# EAGLE design ESP32-12S (EAGLE 9.7.0)
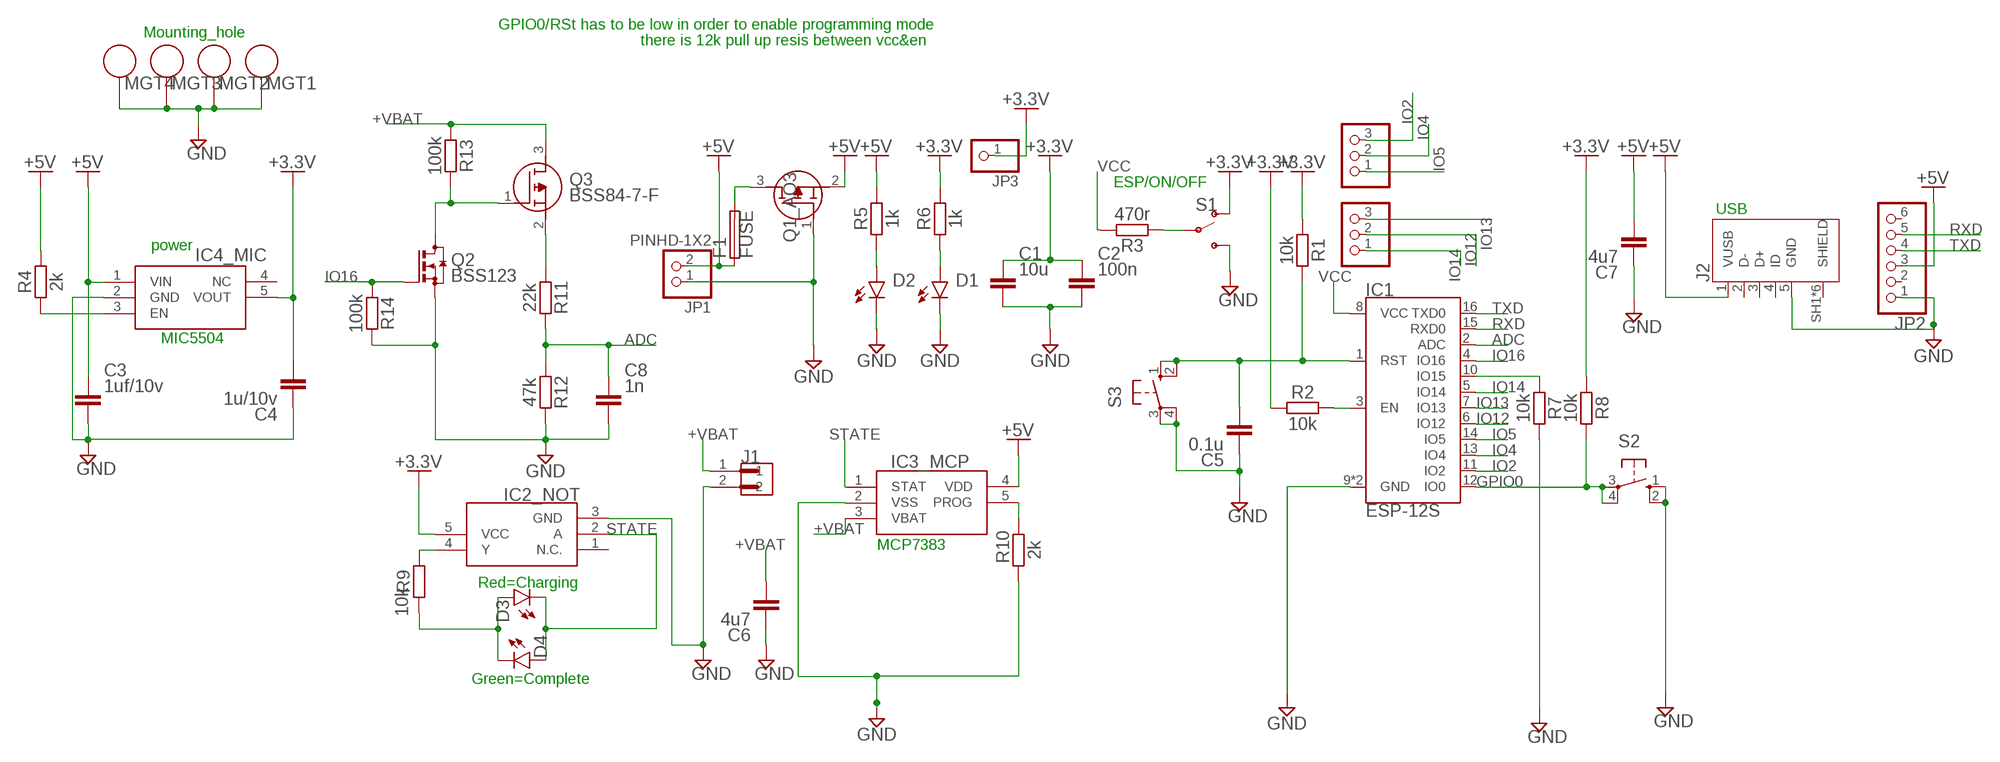
[diagram p0: schematic, sheet 1]

## Parts
C1  10u  C_CHIP-0603(1608-METRIC)  [CAPC1608X85]
C2  100n  C_CHIP-0603(1608-METRIC)  [CAPC1608X85]
C3  1uf/10v  C_CHIP-0805(2012-METRIC)  [CAPC2012X110]
C4  1u/10v  C_CHIP-0805(2012-METRIC)  [CAPC2012X110]
C5  0.1u  C_CHIP-0603(1608-METRIC)  [CAPC1608X85]
C6  4u7  C_CHIP-0603(1608-METRIC)  [CAPC1608X85]
C7  4u7  C_CHIP-0603(1608-METRIC)  [CAPC1608X85]
C8  1n  C_CHIP-0603(1608-METRIC)  [CAPC1608X85]
D1  CHIP-ROUND-R_0805  [LEDC2012X105N_RND-R]
D2  CHIP-ROUND-R_0805  [LEDC2012X105N_RND-R]
D3  CHIP-ROUND-R_0805  [LEDC2012X105N_RND-R]
D4  CHIP-ROUND-R_0805  [LEDC2012X105N_RND-R]
F1  FUSE  FUSE_CHIP-0603(1608-METRIC)  [FUSC1608X60N]
IC1  ESP-12S  [ESP-12S]
IC2_NOT  74HC1G04GW,125  [SOT65P212X110-5N]
IC3_MCP  MCP73831T-2ATI_OT  [SOT95P270X145-5N]
IC4_MIC  MIC5504-3.3YM5-TR  [SOT95P280X145-5N]
J1  S2B-XH-A(LF)(SN)  [JST_S2B-XH-A(LF)(SN)]
J2  10118192-0001LF  [AMPHENOL_10118192-0001LF]
JP1  PINHD-1X2  [1X02]
JP2  PINHD-1X6  [1X06]
JP3  PINHD-1X1  [1X01]
JP4  PINHD-1X3  [1X03]
JP5  PINHD-1X3  [1X03]
MGT1  BEAGLEBONEBLACK_MOUNTING_HOLE  [BEAGLEBONEBLACK_MOUNTING_HOLE]
MGT2  BEAGLEBONEBLACK_MOUNTING_HOLE  [BEAGLEBONEBLACK_MOUNTING_HOLE]
MGT3  BEAGLEBONEBLACK_MOUNTING_HOLE  [BEAGLEBONEBLACK_MOUNTING_HOLE]
MGT4  BEAGLEBONEBLACK_MOUNTING_HOLE  [BEAGLEBONEBLACK_MOUNTING_HOLE]
Q1_AO3  AO3401A  [SOT95P280X125-3N]
Q2  BSS123  [SOT23]
Q3  BSS84-7-F  [SOT96P240X110-3N]
R1  10k  R_CHIP-0603(1608-METRIC)  [RESC1608X60]
R2  10k  R_CHIP-0603(1608-METRIC)  [RESC1608X60]
R3  470r  R_CHIP-0603(1608-METRIC)  [RESC1608X60]
R4  2k  R_CHIP-0603(1608-METRIC)  [RESC1608X60]
R5  1k  R_CHIP-0603(1608-METRIC)  [RESC1608X60]
R6  1k  R_CHIP-0603(1608-METRIC)  [RESC1608X60]
R7  10k  R_CHIP-0603(1608-METRIC)  [RESC1608X60]
R8  10k  R_CHIP-0603(1608-METRIC)  [RESC1608X60]
R9  10k  R_CHIP-0603(1608-METRIC)  [RESC1608X60]
R10  2k  R_CHIP-0603(1608-METRIC)  [RESC1608X60]
R11  22k  R_CHIP-1206(3216-METRIC)  [RESC3216X70]
R12  47k  R_CHIP-1206(3216-METRIC)  [RESC3216X70]
R13  100k  R_CHIP-1206(3216-METRIC)  [RESC3216X70]
R14  100k  R_CHIP-1206(3216-METRIC)  [RESC3216X70]
S1  SWITCH-SPDT-SMD-RIGHT-ANGLE  [SWITCH_SPST_SMD_A]
S2  10-XX  [B3F-10XX]
S3  10-XX  [B3F-10XX]

## Nets
+3.3V: C1.1 C2.1 C4.2 IC2_NOT.5(VCC) IC4_MIC.5(VOUT) JP3.1 R1.1 R2.1 R6.2 R8.1 S1.1(O)
+5V: C3.1 C7.2 F1.1 IC3_MCP.4(VDD) IC4_MIC.1(VIN) J2.1(VUSB) JP1.2 JP2.3 Q1_AO3.2(S) R4.2 R5.2
+VBAT: C6.2 IC3_MCP.3(VBAT) J1.1 Q3.3(D) R13.1
ADC: C8.1 IC1.2(ADC) R11.2 R12.1
GND: C1.2 C2.2 C3.2 C4.1 C5.1 C6.1 C7.1 C8.2 D1.C D2.C IC1.9(GND) IC1.P$1(GND) IC2_NOT.3(GND) IC3_MCP.2(VSS) IC4_MIC.2(GND) J1.2 J2.5(GND) JP1.1 JP2.1 MGT1.P$1 MGT2.P$1 MGT3.P$1 MGT4.P$1 Q1_AO3.1(G) Q2.2(S) R7.2 R10.1 R12.2 R14.2 S1.3(S) S2.1(S) S2.2(S1) S3.3(P) S3.4(P1)
GPIO0: IC1.12(IO0) R8.2 S2.3(P) S2.4(P1)
IO2: IC1.11(IO2) JP4.3
IO4: IC1.13(IO4) JP4.2
IO5: IC1.14(IO5) JP4.1
IO12: IC1.6(IO12) JP5.2
IO13: IC1.7(IO13) JP5.3
IO14: IC1.5(IO14) JP5.1
IO16: IC1.4(IO16) Q2.1(G) R14.1
N$2: IC1.3(EN) R2.2
N$3: IC4_MIC.3(EN) R4.1
N$4: D1.A R6.1
N$5: D2.A R5.1
N$7: IC1.10(IO15) R7.1
N$9: F1.2 Q1_AO3.3(D)
N$10: IC3_MCP.5(PROG) R10.2
N$11: R3.1 S1.2(P)
N$12: Q3.2(S) R11.1
N$13: IC2_NOT.4(Y) R9.2
N$14: D3.A D4.C R9.1
N$15: Q2.3(D) Q3.1(G) R13.2
RST: C5.2 IC1.1(RST) R1.2 S3.1(S) S3.2(S1)
RXD: IC1.15(RXD0) JP2.5
STATE: D3.C D4.A IC2_NOT.2(A) IC3_MCP.1(STAT)
TXD: IC1.16(TXD0) JP2.4
VCC: IC1.8(VCC) R3.2
Unconnected: IC2_NOT.1(N.C.) IC4_MIC.4(NC) J2.2(D-) J2.3(D+) J2.4(ID) J2.SH1(SHIELD) J2.SH2(SHIELD) J2.SH3(SHIELD) J2.SH4(SHIELD) J2.SH5(SHIELD) J2.SH6(SHIELD) JP2.2 JP2.6

## Notes on the sheet
- GPIO0/RSt has to be low in order to enable programming mode
- Mounting_hole
- there is 12k pull up resis between vcc&en
- ESP/ON/OFF
- USB
- power
- MIC5504
- MCP7383
- Red=Charging
- Green=Complete

## Library data of the parts
C1-C8 = Capacitor:C: Capacitor - Generic; CATEGORY: Capacitor
D1-D4 = LED:CHIP-ROUND-R: LED - Generic; CATEGORY: LED; COLOR: RED; DESCRIPTION: CHIP LED ROUND; SUB-CATEGORY: CHIP; TYPE: ROUND_TOP
F1 = Circuit-Protection:FUSE: Fuse - Generic; CATEGORY: Circuit-Protection; SUB-CATEGORY: Fuse
IC1 = ESP-12SSS:ESP-12S: AI-Thinker ESP-12S ESP-12S WiFi module is developed by AI-Thinker Co.,Ltd, core processor ESP8266 in smaller sizes of the module encapsulates Tensilica L106 integrates industry-leading ultra low power 32-bit MCU micro, with the 16-bit short mode, clock speed support 80 MHz, 160 MHz, supports the RTOS, integrated Wi-Fi MAC/BB/RF/PA/LNA, on-board antennas.; PROD_ID: IC-14115
IC2_NOT = NOT_74HC1G04GW_125:74HC1G04GW,125: Nexperia 74HC1G04GW,125 CMOS Inverter, 2 6 V, 5-Pin TSSOP Source: Datasheet <https://assets.nexperia.com/documents/data-sheet/74HC_HCT1G04.pdf>; ARROW_PART_NUMBER: 74HC1G04GW,125; ARROW_PRICE-STOCK: https://www.arrow.com/en/products/74hc1g04gw125/nexperia; DESCRIPTION: Nexperia 74HC1G04GW,125 CMOS Inverter, 2 6 V, 5-Pin TSSOP; HEIGHT: 1.1mm; MANUFACTURER_NAME: Nexperia; MANUFACTURER_PART_NUMBER: 74HC1G04GW,125; MOUSER_PART_NUMBER: 771-74HC1G04GW-G; MOUSER_PRICE-STOCK: https://www.mouser.co.uk/ProductDetail/Nexperia/74HC1G04GW125?qs=P62ublwmbi%2FJWY9CPTNoyA%3D%3D
IC3_MCP = MCP73831T-2ATI_OT:MCP73831T-2ATI_OT: Microchip MCP73831T-2ATI/OT, Battery Charge Controller Lithium-Ion/Polymer, 500mA, 5-pin SOT-23 Source: Datasheet <http://docs-emea.rs-online.com/webdocs/1381/0900766b81381747.pdf>; ARROW_PART_NUMBER: MCP73831T-2ATI/OT; ARROW_PRICE-STOCK: https://www.arrow.com/en/products/mcp73831t-2atiot/microchip-technology; DESCRIPTION: Microchip MCP73831T-2ATI/OT, Battery Charge Controller Lithium-Ion/Polymer, 500mA, 5-pin SOT-23; HEIGHT: 1.45mm; MANUFACTURER_NAME: Microchip; MANUFACTURER_PART_NUMBER: MCP73831T-2ATI/OT; MOUSER_PART_NUMBER: 579-MCP73831T-2ATIOT; MOUSER_PRICE-STOCK: https://www.mouser.co.uk/ProductDetail/Microchip-Technology/MCP73831T-2ATI-OT?qs=yUQqVecv4qsZbioEUu%252B83g%3D%3D
IC4_MIC = MIC5504-3.3YM5-TR:MIC5504-3.3YM5-TR: MICROCHIP - MIC5504-3.3YM5-TR - LDO VOLT REG, 0.3A, 3.3V, SOT-23-5 Source: Datasheet <https://componentsearchengine.com/Datasheets/2/MIC5504-3.3YM5-TR.pdf>; ARROW_PART_NUMBER: MIC5504-3.3YM5-TR; ARROW_PRICE-STOCK: https://www.arrow.com/en/products/mic5504-3.3ym5-tr/microchip-technology; DESCRIPTION: MICROCHIP - MIC5504-3.3YM5-TR - LDO VOLT REG, 0.3A, 3.3V, SOT-23-5; HEIGHT: 1.45mm; MANUFACTURER_NAME: Microchip; MANUFACTURER_PART_NUMBER: MIC5504-3.3YM5-TR; MOUSER_PART_NUMBER: 998-MIC5504-3.3YM5TR; MOUSER_PRICE-STOCK: https://www.mouser.co.uk/ProductDetail/Microchip-Technology-Micrel/MIC5504-33YM5-TR/?qs=U6T8BxXiZAUmVQ5Zs217qQ%3D%3D
J1 = S2B-XH-A_LF__SN_(2.54mm):S2B-XH-A(LF)(SN): XH Series 2.5mm 2 Position Through Hole Shrouded Header Connector; MANUFACTURER: JST
J2 = USB-micro:10118192-0001LF: Single Port 5 Contact Horizontal Right Angle Shielded Micro B USB 2.0 Connector; MANUFACTURER: Amphenol; PARTREV: B; STANDARD: Manufacturer Recommendation
JP1 = Connector:PINHD-1X2: PIN HEADER; CATEGORY: CONNECTOR; SUB-CATEGORY: PIN-HEADER
JP2 = Connector:PINHD-1X6: PIN HEADER; CATEGORY: CONNECTOR; SUB-CATEGORY: PIN-HEADER
JP3 = Connector:PINHD-1X1: PIN HEADER; CATEGORY: CONNECTOR; SUB-CATEGORY: PIN-HEADER
JP4 JP5 = Connector:PINHD-1X3: PIN HEADER; CATEGORY: CONNECTOR; SUB-CATEGORY: PIN-HEADER
MGT1-MGT4 = BeagleBone_Black_Wireless:BEAGLEBONEBLACK_MOUNTING_HOLE: Chassis Mounting Hole w/GND connection ability
Q1_AO3 = AO3401A:AO3401A: 30V P-Channel MOSFET Source: Datasheet <http://www.aosmd.com/pdfs/datasheet/AO3401A.pdf>; ARROW_PART_NUMBER: AO3401A; ARROW_PRICE-STOCK: https://www.arrow.com/en/products/ao3401a/alpha-and-omega-semiconductor; DESCRIPTION: 30V P-Channel MOSFET; HEIGHT: 1.25mm; MANUFACTURER_NAME: Alpha & Omega Semiconductors; MANUFACTURER_PART_NUMBER: AO3401A
Q2 = BSS123:BSS123: N-CHANNEL MOS FET
Q3 = BSS84-7-F:BSS84-7-F: MOSFET P-Channel 50V 0.13A SOT23 Diodes Inc BSS84-7-F P-channel MOSFET Transistor, 0.13 A, -50 V, 3-Pin SOT-23 Source: Datasheet <https://www.diodes.com/assets/Datasheets/ds30149.pdf>; ARROW_PART_NUMBER: BSS84-7-F; ARROW_PRICE-STOCK: https://www.arrow.com/en/products/bss84-7-f/diodes-incorporated; DESCRIPTION: MOSFET P-Channel 50V 0.13A SOT23 Diodes Inc BSS84-7-F P-channel MOSFET Transistor, 0.13 A, -50 V, 3-Pin SOT-23; HEIGHT: 1.1mm; MANUFACTURER_NAME: Diodes Inc.; MANUFACTURER_PART_NUMBER: BSS84-7-F; MOUSER_PART_NUMBER: 621-BSS84-F; MOUSER_PRICE-STOCK: https://www.mouser.co.uk/ProductDetail/Diodes-Incorporated/BSS84-7-F?qs=7h%252BLin1yaw0vxJLRgtEgKA%3D%3D
R1-R14 = Resistor:R: Resistor Fixed - Generic; CATEGORY: Resistor; SUB-CATEGORY: Fixed
S1 = One_Dimensional_Pong:SWITCH-SPDT: Single Pole, Double Throw (SPDT) Switch Single-pole, double-throw (SPDT) switch. Variant Overview SMD-AYZ0202 Surface Mount DPDT Switch <https://www.sparkfun.com/products/597> (COM-00597) Used on e.g. LilyPad Arduino USB - ATmega32U4 Board <https://www.sparkfun.com/products/12049> PTH-11.6X4.0MM SPDT Mini Power Switch <https://www.sparkfun.com/products/102> (COM-00102) Used on e.g. SparkFun Simon Says - Through-Hole Soldering Kit <https://www.sparkfun.com/products/10547> (KIT-10547) PTH-11.6X4.0MM-KIT KIT version of SPDT Mini Power Switch - Simplifies soldering by removing tStop of switch pins - only one side can be soldered. PTH-11.6X4.0MM-LOCK LOCK version of SPDT Mini Power Switch - Offset pins hold switch in place for easier soldering. SMD-RIGHT-ANGLE Surface Mount Right Angle Switch <https://www.sparkfun.com/products/10860> (COM-10860) Used on e.g. SparkFun ESP8266 Thing <https://www.sparkfun.com/products/13231>; PROD_ID: SWCH-10651; SF_ID: COM-00597; SF_SKU: COM-10860
S2 S3 = DC_LOAD_AU:10-XX: OMRON SWITCH; MPN: B3F-1000; OC_FARNELL: 176432; OC_NEWARK: 36M3542

## Board
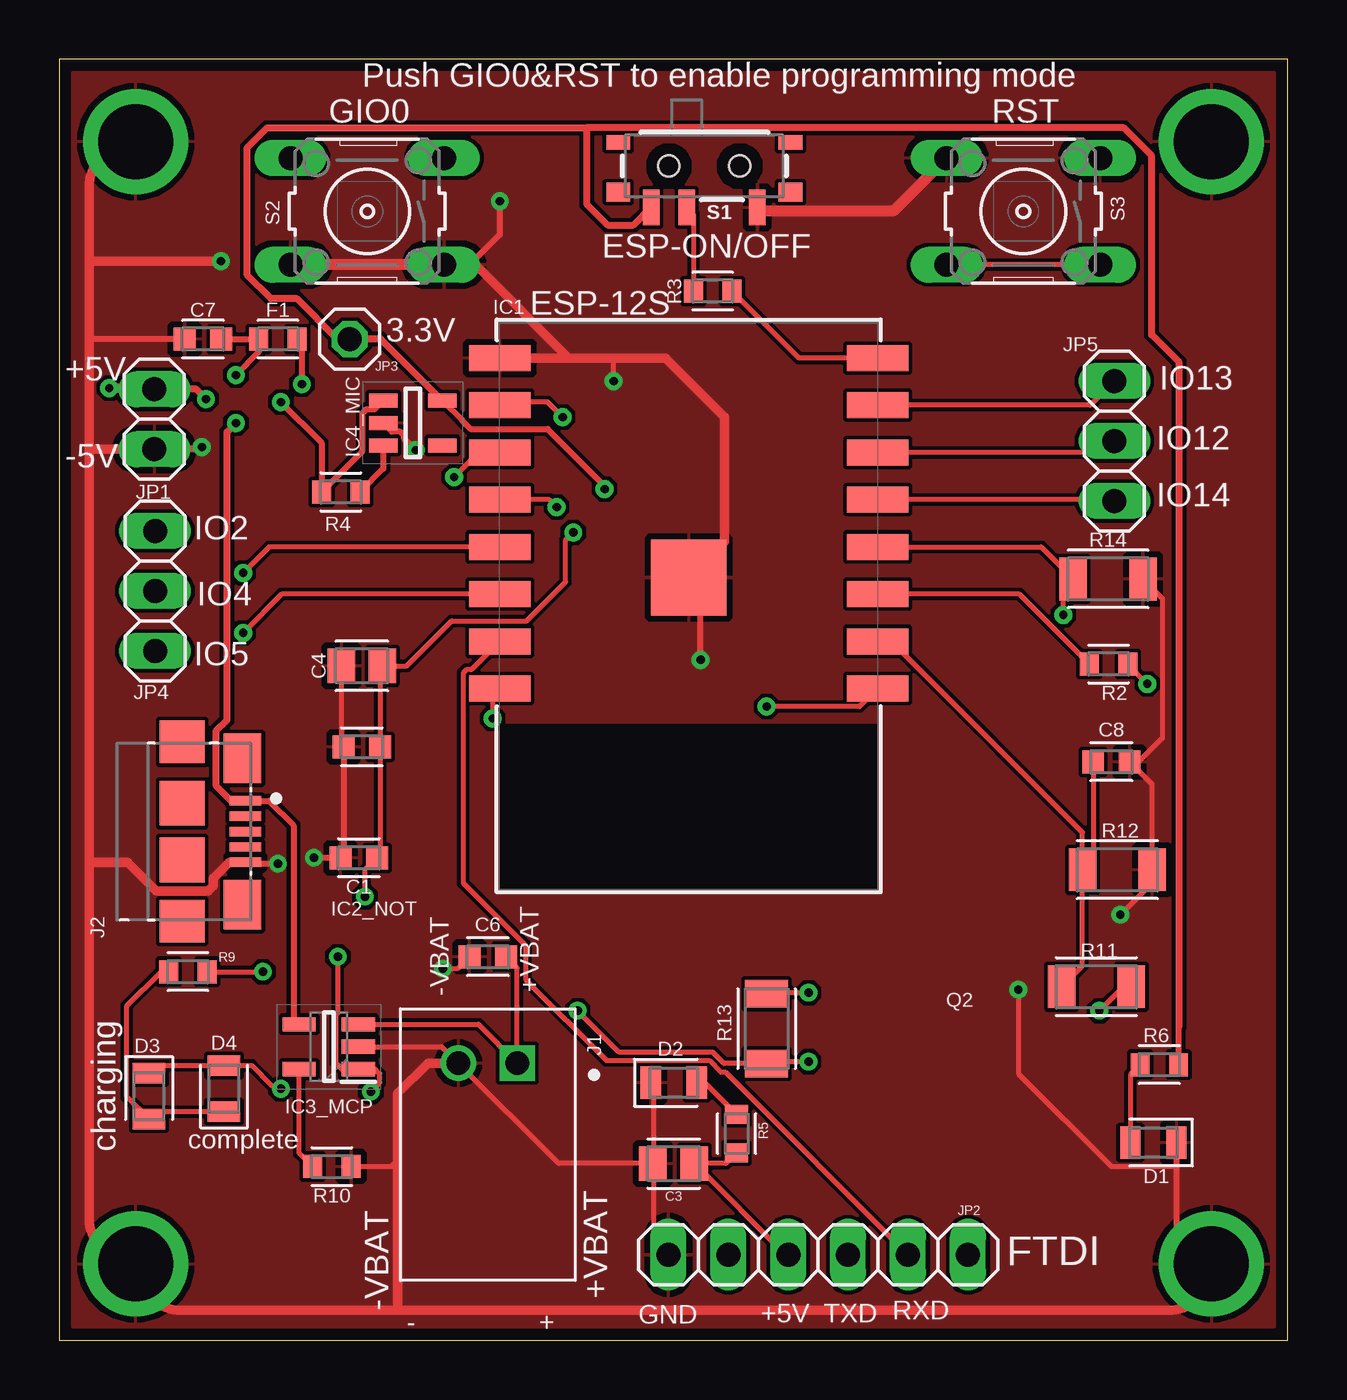
[diagram p1: board, top side]
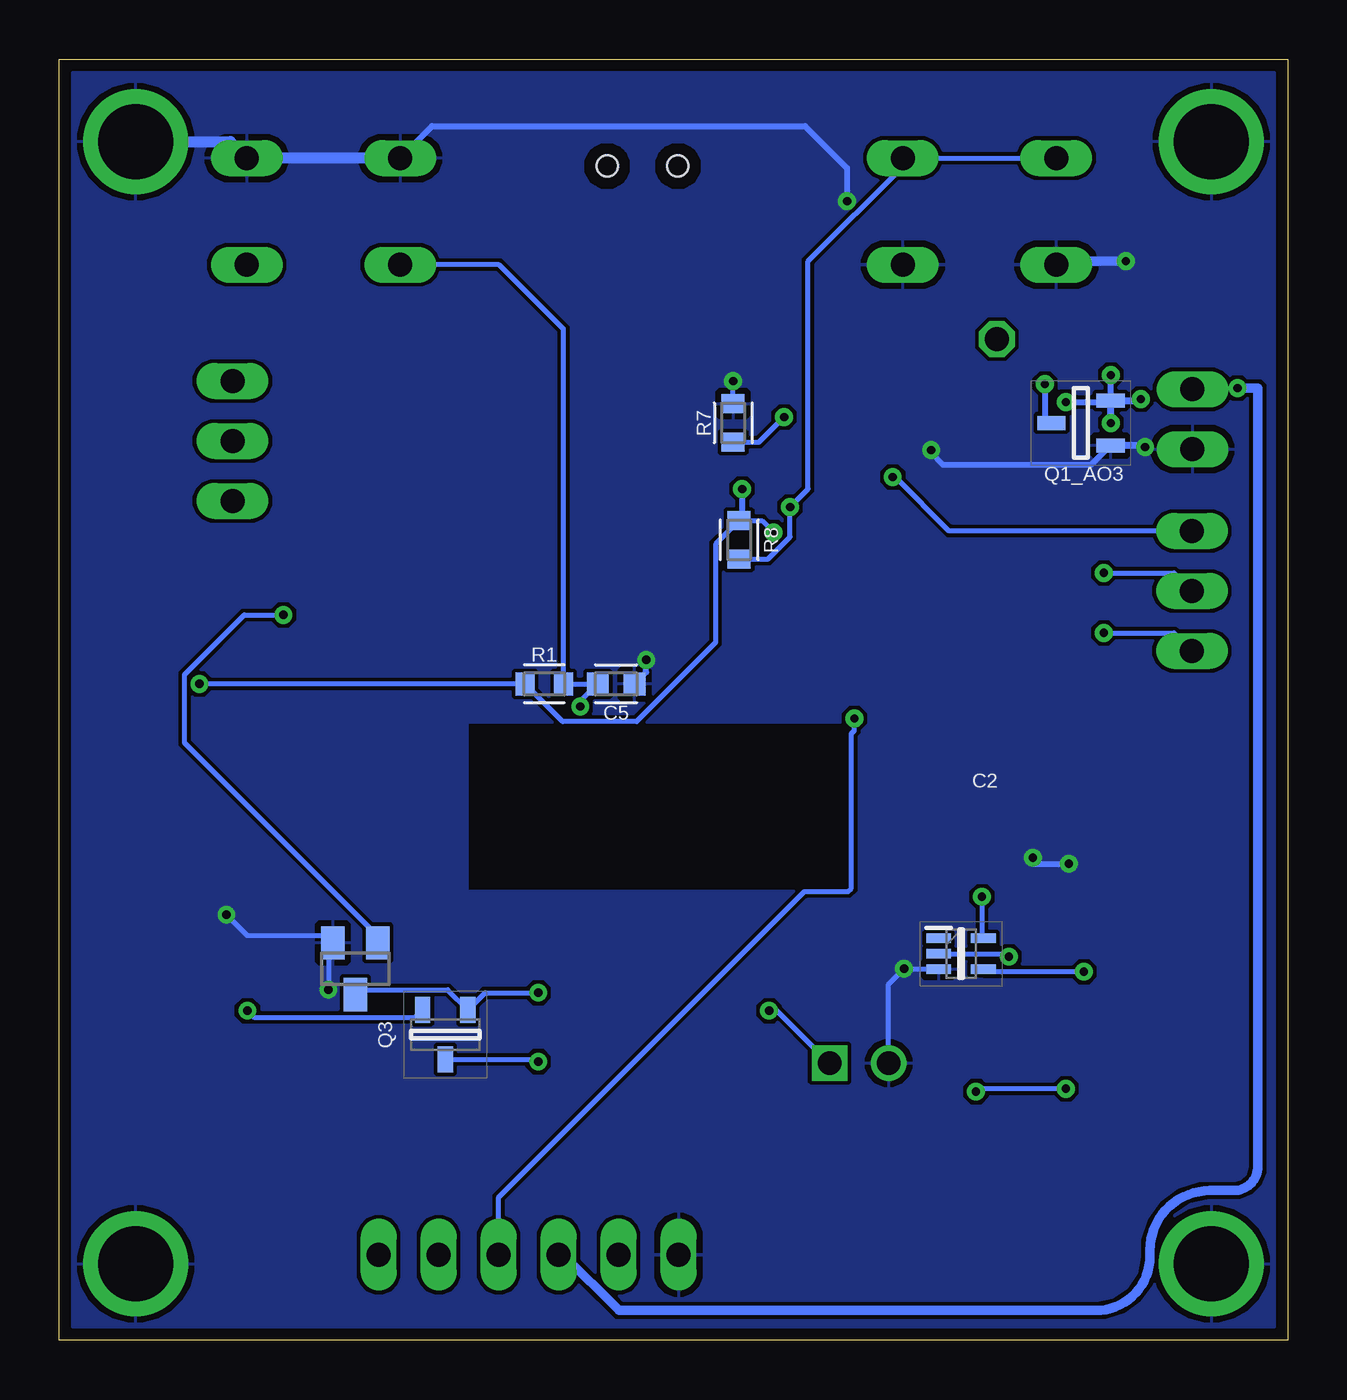
[diagram p2: board, bottom side, seen from below]

Size 52.05 x 54.28 mm. Coordinates in mm from the lower left corner, seen from the top.
Outline: 0,0 52.05,0 52.05,54.28 0,54.28 0,0
Copper layers (1*16): Top 0.035mm / dielectric 1.5mm / Bottom 0.035mm
Design rules "default *": minimum track width 6mil, minimum drill 0.35mm, track to track 6mil, track to pad 6mil, pad to pad 6mil, via to via 6mil, smd to smd 6mil, copper to edge 20mil, drill to drill 6mil, minimum pad ring 10mil, minimum via ring 8mil, stop-mask expansion 4mil, vias tented up to drill 0mil, thermal gap 10mil

### Footprints (pad centres in the part's own frame; a part is rotated, then mirrored left to right if it is on the bottom)
CAPC1608X85 = smd 0.921 x 0.97: 1 -0.775,0; 2 0.775,0
CAPC2012X110 = smd 1.165 x 1.465: 1 -0.875,0; 2 0.875,0
LEDC2012X105N_RND-R = smd 0.862 x 1.362: A 0.975,0; C -0.975,0
FUSC1608X60N = smd 0.799 x 0.974: 1 -0.815,0; 2 0.815,0
ESP-12S = smd 2.6 x 1.1: 1 -8,3.5; 2 -8,1.5; 3 -8,-0.5; 4 -8,-2.5; 5 -8,-4.5; 6 -8,-6.5; 7 -8,-8.5; 8 -8,-10.5; 9 8,-10.5; 10 8,-8.5; 11 8,-6.5; 12 8,-4.5; 13 8,-2.5; 14 8,-0.5; 15 8,1.5; 16 8,3.5 | smd 3.2 x 3.2: P$1 0,-1.2
SOT65P212X110-5N = smd 1.05 x 0.4: 1 -0.95,0.65; 2 -0.95,0; 3 -0.95,-0.65; 4 0.95,-0.65; 5 0.95,0.65
SOT95P270X145-5N = smd 1.4 x 0.6: 1 -1.25,0.95; 2 -1.25,0; 3 -1.25,-0.95; 4 1.25,-0.95; 5 1.25,0.95
SOT95P280X145-5N = smd 1.2 x 0.6: 1 -1.25,0.95; 2 -1.25,0; 3 -1.25,-0.95; 4 1.25,-0.95; 5 1.25,0.95
JST_S2B-XH-A(LF)(SN) = drill 1 square: 1 -1.25,0 | drill 1: 2 1.25,0
AMPHENOL_10118192-0001LF = smd 0.4 x 1.35: 1 -1.3,0; 2 -0.65,0; 3 0,0; 4 0.65,0; 5 1.3,0 | smd 2.1 x 1.6: SH1 -3.1,-0.125; SH2 3.1,-0.125 | smd 1.8 x 1.9: SH3 -3.8,-2.675; SH6 3.8,-2.675 | smd 1.9 x 1.9: SH4 -1.2,-2.675; SH5 1.2,-2.675
1X02 = drill 1.016 long: 1 -1.27,0; 2 1.27,0
1X06 = drill 1.016 long: 1 -6.35,0; 2 -3.81,0; 3 -1.27,0; 4 1.27,0; 5 3.81,0; 6 6.35,0
1X01 = drill 1.016 octagon: 1 0,0
1X03 = drill 1.016 long: 1 -2.54,0; 2 0,0; 3 2.54,0
BEAGLEBONEBLACK_MOUNTING_HOLE = drill 3.175 pad 4.445: P$1 0,0
SOT95P280X125-3N = smd 1.2 x 0.6: 1 -1.25,0.95; 2 -1.25,-0.95; 3 1.25,0
SOT23 = smd 1 x 1.4: 1 -0.95,-1.1; 2 0.95,-1.1; 3 0,1.1
SOT96P240X110-3N = smd 1.1 x 0.65: 1 -1.05,0.96; 2 -1.05,-0.96; 3 1.05,0
RESC1608X60 = smd 0.799 x 0.974: 1 -0.815,0; 2 0.815,0
RESC3216X70 = smd 1.165 x 1.815: 1 -1.475,0; 2 1.475,0
SWITCH_SPST_SMD_A = smd 0.7 x 1.5: 1 -2.25,-1.75; 2 -0.75,-1.75; 3 2.25,-1.75 | smd 1 x 0.6: GND1 -3.65,1; GND3 3.65,1 | smd 1 x 0.8: GND2 -3.65,-1.1; GND4 3.65,-1.1 | hole 0.9: -1.5,0; 1.5,0
B3F-10XX = drill 1.016 long: 1 -3.251,2.261; 2 3.251,2.261; 3 -3.251,-2.261; 4 3.251,-2.261

### Placement (x,y rotation side)
C1  12.7,20.45 180 top
C2  12.83,25.15 180 top
C3  26.04,7.49 180 top
C4  12.83,28.57 0 top
C5  28.45,27.81 180 bottom
C6  18.16,16.26 0 top
C7  6.1,42.42 0 top
C8  44.58,24.51 0 top
D1  46.35,8.38 180 top
D2  26.04,10.92 0 top
D3  3.81,10.35 270 top
D4  6.99,10.67 90 top
F1  9.27,42.42 0 top
IC1  26.67,31.11 180 top
IC2_NOT  13.84,16.38 0 bottom
IC3_MCP  11.43,12.45 180 top
IC4_MIC  14.99,38.86 0 top
J1  18.16,11.75 180 top
J2  7.9,21.56 270 top
JP1  4.04,39.02 90 top
JP2  32.16,3.63 0 top
JP3  12.32,42.42 0 top
JP4  4.06,31.75 90 top
JP5  44.7,38.1 90 top
MGT1  48.81,3.24 0 top
MGT2  48.81,50.79 0 top
MGT3  3.24,3.24 0 top
MGT4  3.24,50.79 0 top
Q1_AO3  8.76,38.86 180 bottom
Q2  39.5,15.75 180 bottom
Q3  35.69,12.95 270 bottom
R1  31.5,27.81 0 bottom
R2  44.45,28.66 180 top
R3  27.69,44.45 0 top
R4  11.94,35.94 180 top
R5  28.7,8.76 270 top
R6  46.61,11.68 0 top
R7  23.5,38.86 90 bottom
R8  23.24,33.91 270 bottom
R9  5.46,15.62 0 top
R10  11.56,7.37 180 top
R11  43.94,14.99 180 top
R12  44.83,19.94 0 top
R13  29.97,13.21 90 top
R14  44.43,32.26 0 top
S1  27.33,49.74 0 top
S2  13.06,47.83 180 top
S3  40.85,47.83 180 top

### Tracks (layer width: path | path; a pad name or v marks a point on that pad's centre or on a via)
+3.3V  (via drill 0.35)
  Top 0.203: v12.95,18.8 12.95,19.93 C1.1 13.6,20.57 C2.1 13.6,28.47 C4.2 14.73,28.57 16.64,30.48 19.81,30.48 21.46,32.13 21.46,33.91 v21.78,34.23 | v46.1,27.81 45.27,28.64 R2.1 | 16.7,39.81 IC4_MIC.5
  Top 0.254: R6.2 47.42,13.29 47.45,13.32 | IC4_MIC.5 17.09,38.96 17.09,38.95 17.43,38.61 20.7,38.61 23.11,36.2 v23.11,36.07
  Top 0.305: IC4_MIC.5 13.63,42.42 JP3.1 11.79,42.42 10.08,44.12 8.98,44.12 7.98,45.13 7.98,50.53 8.81,51.36 22.35,51.36 | 22.35,51.36 45.1,51.36 46.28,50.17 46.28,42.6 47.45,41.44 47.45,13.32 | S1.1 24.33,47.24 23.24,47.24 22.35,48.13 22.35,51.36
  Bottom 0.203: v12.95,18.8 12.95,17.09 IC2_NOT.5 | 22.93,34.42 R8.1 | v46.1,27.81 R1.1 30.72,26.22 27.59,26.22 24.24,29.57 24.24,33.73 R8.1 | R8.1 22.28,34.72 v21.78,34.23
  Bottom 0.254: v23.11,36.07 23.11,34.85 R8.1
+5V  (via drill 0.35)
  Top 0.203: JP2.3 30.77,3.63 C3.1 28.25,7.49 R5.2
  Top 0.254: v7.49,40.89 8.46,41.86 F1.1 C7.2 | J2.1 8.88,22.86 8.89,22.86 9.93,21.82 9.93,13.65 IC3_MCP.4 | v9.4,39.75 11.12,38.03 R4.2 12.86,37.67 12.86,39.28 13.02,39.44 13.37,39.44 IC4_MIC.1
  Top 0.305: v6.22,39.88 5.81,40.29 3.94,40.29 | v7.49,38.86 7.11,38.48 7.11,26.28 6.67,25.83 6.67,23.48 7.29,22.86 J2.1
  Top 0.406: 3.94,40.29 JP1.2 3.99,40.34 v2.13,40.34
  Bottom 0.254: v7.49,40.89 7.51,40.87 Q1_AO3.2 7.57,39.75 v9.4,39.75
  Bottom 0.305: v6.22,39.88 6.29,39.81 Q1_AO3.2 7.49,39.79 v7.49,38.86
  Bottom 0.406: v2.13,40.34 1.27,40.34 1.27,7.37 arc90 2.29,6.35 3.3,6.35 arc-90 5.84,3.81 5.84,3.56 arc90 8.13,1.27 28.33,1.27 30.69,3.63 JP2.3
+VBAT  (via drill 0.35)
  Top 0.203: C6.2 19.41,15.78 J1.1 17.76,13.4 IC3_MCP.3 | v31.75,11.81 30.05,11.81 R13.1 28.17,11.73 27.69,12.21 23.73,12.21 v21.97,13.97
  Bottom 0.203: Q3.3 31.84,11.9 v31.75,11.81 | v21.97,13.97 21.63,13.97 J1.1
ADC
  Top 0.203: C8.1 43.8,20.39 R12.1 | R12.1 43.36,15.88 R11.2 | R12.1 43.36,21.52 35.26,29.61 IC1.2
GND  (via drill 0.35)
  Top 0.203: C6.1 16.88,15.75 v16.26,15.75 | IC3_MCP.2 16.21,12.45 J1.2 21.17,7.49 C3.2 25.17,7.48 | R10.1 14.1,7.37 14.35,7.62 | 25.17,7.48 25.17,4.26 JP2.1 | D2.C 25.17,10.81 25.17,7.48 | C4.1 11.95,25.25 C2.2 | v44.96,18.03 46.1,19.18 46.1,19.73 R12.2 46.31,23.56 C8.2 45.72,24.51 46.74,25.53 46.74,31.43 R14.2 | v23.5,40.64 23.5,41.62 | v40.64,14.86 40.64,11.3 44.58,7.37 47.33,7.37
  Top 0.254: C7.1 1.27,42.42 | C2.2 12.05,20.57 C1.2 v10.79,20.45 | v9.27,20.19 7.96,20.19 J2.5 | IC1.9 18.24,41.62 | v27.18,28.83 27.18,31.81 IC1.P$1 | D1.C 47.33,7.37 47.33,4.72 MGT1.P$1 | IC4_MIC.2 14.11,38.49 14.45,38.49 14.62,38.33 14.62,38.21 v15.11,37.72 | v18.67,48.26 18.67,46.84 17.4,45.57
  Top 0.305: v6.05,37.85 5.95,37.75 JP1.1
  Top 0.406: 1.27,45.72 1.27,42.42 1.27,37.75 | 1.27,37.75 1.27,20.32 | 1.27,20.32 1.27,5.21 arc90 MGT3.P$1 arc90 5.21,1.27 14.35,1.27 | 14.35,1.27 46.97,1.27 arc90 48.81,3.11 MGT1.P$1 | JP1.1 1.27,37.75 | 1.27,20.32 1.33,20.25 2.92,20.25 4.12,19.05 6.32,19.05 6.53,19.26 6.53,19.56 7.22,20.25 J2.5 | J1.2 15.64,11.75 14.35,10.46 14.35,7.62 14.35,1.27 | 1.27,45.72 v6.86,45.72 | IC1.P$1 28.19,33.84 28.19,39.12 25.7,41.62 23.5,41.62 21.59,41.62 | 21.59,41.62 IC1.9 | 21.59,41.62 17.64,45.57 17.4,45.57 S2.1 | 1.27,45.72 1.27,48.82 arc-90 MGT4.P$1
  Top 0.457: S2.1 S2.2 | S1.3 29.71,47.86 35.37,47.86 S3.4
  Bottom 0.152: Q2.2 40.64,16.66
  Bottom 0.203: IC2_NOT.3 16.24,15.73 v16.26,15.75 16.91,15.09 J1.2 | Q2.2 40.74,17.14 44.07,17.14 v44.96,18.03 | R7.2 v23.5,40.64 | 40.64,16.66 v40.64,14.86
  Bottom 0.254: v10.79,20.45 10.79,20.19 v9.27,20.19 | Q1_AO3.1 8.34,37.08 14.61,37.08 15.11,37.58 v15.11,37.72 | C5.1 27.18,28.31 v27.18,28.83 | S3.4 36.25,51.44 20.45,51.44 18.67,49.66 v18.67,48.26
  Bottom 0.305: Q1_AO3.1 6.16,37.91 6.1,37.85 v6.05,37.85
  Bottom 0.406: v6.86,45.72 9.65,45.72 S2.2
  Bottom 0.457: MGT2.P$1 44.8,50.79 S3.3 S3.4
  pour Top: 0.25,54.1 0.25,53.98 52.07,53.98 52.07,0.13 0,0.13 0,53.98 0.25,53.98
  pour Bottom: 0.38,54.1 51.94,54.1 51.94,0.38 0.25,0.38 0.25,54.1 0.25,53.98 0.25,54.61 0,54.61
GPIO0  (via drill 0.35)
  Top 0.203: v21.08,35.31 20.77,35.62 IC1.12
  Bottom 0.203: R8.2 22.02,33.09 21.08,34.04 v21.08,35.31 20.32,36.07 20.32,45.72 16.31,49.73 S2.3 S2.4
IO2  (via drill 0.35)
  Top 0.203: IC1.11 17.77,37.62 v16.74,36.58
  Bottom 0.203: JP4.3 14.35,34.29 16.63,36.58 v16.74,36.58
IO4  (via drill 0.35)
  Top 0.203: IC1.13 8.9,33.62 v7.79,32.51
  Bottom 0.203: JP4.2 4.83,32.51 v7.79,32.51
IO5  (via drill 0.35)
  Top 0.203: IC1.14 9.44,31.61 v7.79,29.97
  Bottom 0.203: JP4.1 4.83,29.97 v7.79,29.97
IO12
  Top 0.203: JP5.2 44.22,37.62 IC1.6
IO13
  Top 0.203: JP5.3 43.68,39.62 IC1.7
IO14
  Top 0.203: JP5.1 44.65,35.62 IC1.5
IO16  (via drill 0.35)
  Top 0.203: IC1.4 41.6,33.62 R14.1 42.55,31.84 v42.55,30.73
  Bottom 0.203: Q2.1 38.55,17.13 46.73,25.32 46.73,28.2 44.2,30.73 v42.55,30.73
N$2
  Top 0.203: IC1.3 40.68,31.61 R2.2
N$3
  Top 0.254: IC4_MIC.3 13.74,36.92 R4.1
N$4
  Top 0.203: R6.1 45.38,11.27 D1.A
N$5
  Top 0.203: D2.A 27.36,10.92 R5.1
N$7  (via drill 0.35)
  Top 0.203: v21.34,39.12 20.7,39.75 18.81,39.75 IC1.10
  Bottom 0.203: R7.1 22.41,38.05 v21.34,39.12
N$9  (via drill 0.35)
  Top 0.254: F1.2 10.29,42.22 v10.29,40.51
  Bottom 0.254: v10.29,40.51 10.29,39.14 Q1_AO3.3
N$10
  Top 0.203: IC3_MCP.5 10.18,7.93 R10.2
N$11
  Top 0.203: S1.2 26.87,47.71 R3.1
N$12  (via drill 0.35)
  Top 0.203: v44.07,13.97 45.09,14.99 R11.1
  Bottom 0.203: v44.07,13.97 43.79,13.69 36.96,13.69 Q3.2
N$13  (via drill 0.35)
  Top 0.203: R9.2 v8.64,15.62
  Bottom 0.203: v8.64,15.62 12.78,15.62 IC2_NOT.4
N$14
  Top 0.203: R9.1 4.32,15.62 2.88,14.18 2.88,10.31 D3.A 4.12,9.69 D4.C
N$15  (via drill 0.35)
  Top 0.203: v31.75,14.73 30.02,14.73 R13.2
  Bottom 0.203: v31.75,14.73 34,14.73 Q3.1 35.58,14.86 39.29,14.86 Q2.3
RST  (via drill 0.35)
  Top 0.203: S3.1 S3.2 | IC1.1 33.91,26.85 v29.97,26.85
  Bottom 0.203: S3.2 33.41,45.57 30.68,42.84 R1.2 C5.2 29.97,27.07 v29.97,26.85
RXD
  Top 0.203: JP2.5 28.22,11.38 28.03,11.38 27.55,11.86 23.19,11.86 19.77,15.28 19.77,16.73 17.12,19.38 17.12,28.27 17.27,28.42 17.47,28.42 IC1.15
STATE  (via drill 0.35)
  Top 0.203: D3.C 4.12,11.64 D4.A 8.17,11.64 9.02,10.79 9.27,10.79 v9.4,10.66 | v13.21,10.54 13.59,10.92 13.59,11.3 13.4,11.5 IC3_MCP.1 12.61,11.43 12.06,11.43 11.73,11.77 11.73,13.8 11.81,13.89 v11.81,16.26
  Bottom 0.203: v9.4,10.66 13.08,10.66 v13.21,10.54 | IC2_NOT.2 11.94,16.38 v11.81,16.26
TXD  (via drill 0.35)
  Top 0.203: IC1.16 18.36,27.3 v18.36,26.34
  Bottom 0.203: JP2.4 33.43,6.07 20.48,19.01 18.63,19.01 18.49,19.15 18.49,25.71 18.36,25.84 v18.36,26.34
VCC
  Top 0.203: R3.2 31.34,41.62 IC1.8

### Text on the board
tNames: Push GIO0&RST to enable programming mode | GIO0 | RST | ESP-ON/OFF | ESP-12S | 3.3V | +5V | IO13 | IO12 | -5V | IO14 | IO2 | IO4 | IO5 | -VBAT | +VBAT | charging | complete | FTDI | +VBAT | GND | -VBAT | +5V | TXD | RXD | - | +